# EAGLE design gatewayNode (EAGLE 7.2.0)
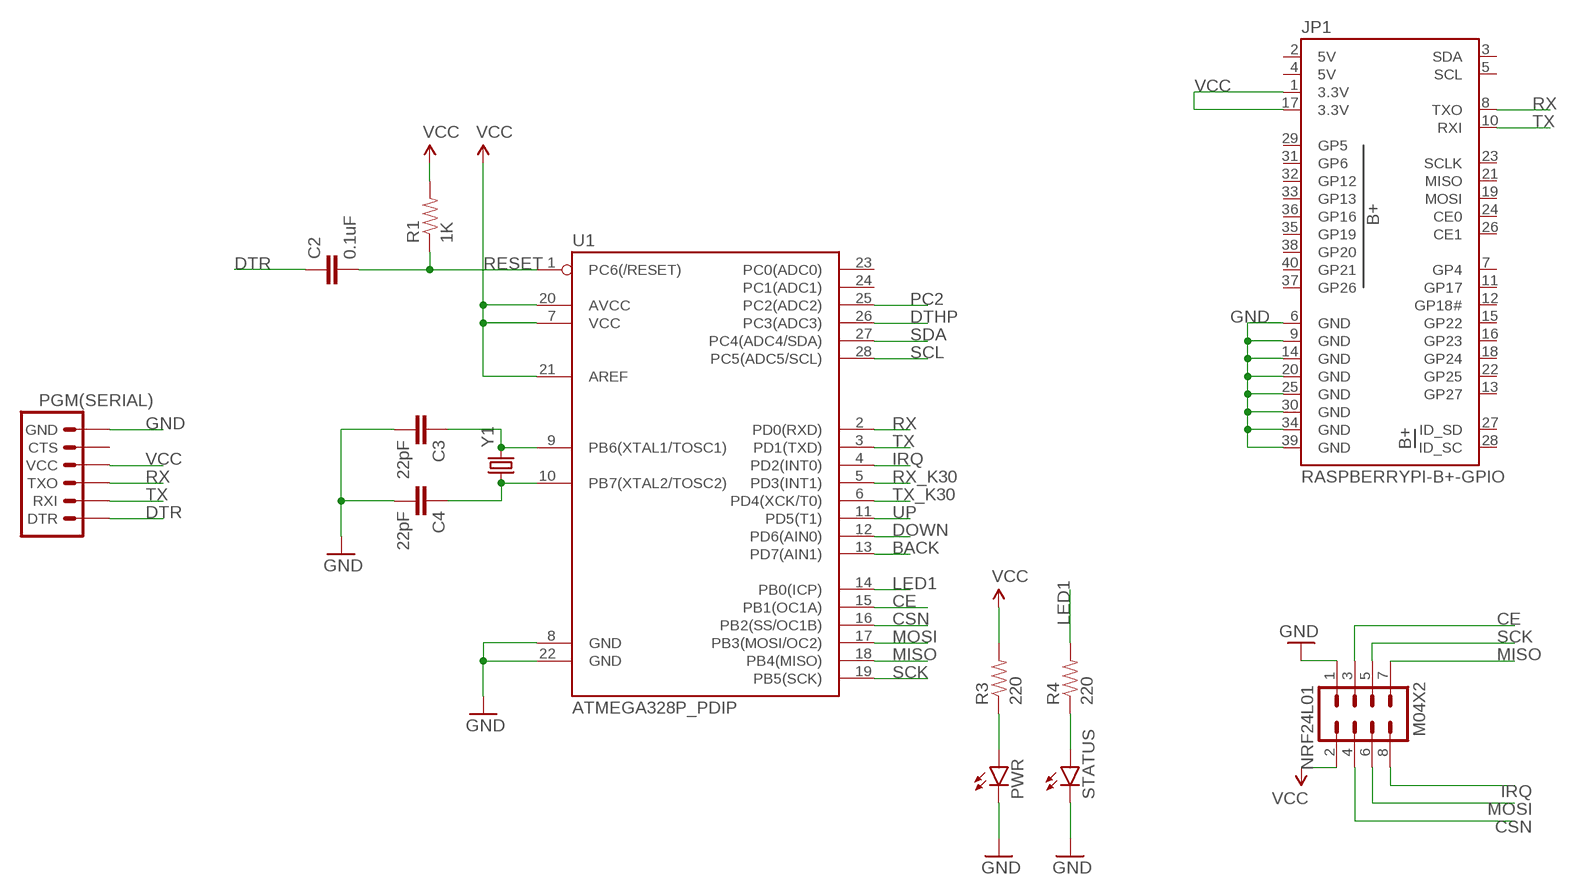
[diagram p0: schematic, sheet 1]

## Parts
C2  0.1uF  0.1UF-25V(+80/-20%)(0603)  [0603-CAP]
C3  22pF  22PF-50V-5%(0603)  [0603-CAP]
C4  22pF  22PF-50V-5%(0603)  [0603-CAP]
JP1  RASPBERRYPI-B+-GPIO  [2X20-SHROUDED]
NRF24L01  M04X2  [2X4]
PGM(SERIAL)  ARDUINO_SERIAL_PROGRAMPTH  [1X06]
PWR  LED0603  [LED-0603]
R1  1K  1KOHM-1/10W-1%(0603)  [0603-RES]
R3  220  1KOHM-1/10W-1%(0603)  [0603-RES]
R4  220  1KOHM-1/10W-1%(0603)  [0603-RES]
STATUS  LED0603  [LED-0603]
U1  ATMEGA328P_PDIP  [DIL28-3]
Y1  CRYSTALHC49US  [HC49US]

## Nets
BACK: U1.13(PD7(AIN1))
CE: NRF24L01.3 U1.15(PB1(OC1A))
CSN: NRF24L01.4 U1.16(PB2(SS/OC1B))
DOWN: U1.12(PD6(AIN0))
DTHP: U1.26(PC3(ADC3))
DTR: C2.1 PGM(SERIAL).1(DTR)
GND: C3.2 C4.2 JP1.6(GND) JP1.9(GND) JP1.14(GND) JP1.20(GND) JP1.25(GND) JP1.30(GND) JP1.34(GND) JP1.39(GND) NRF24L01.1 PGM(SERIAL).6(GND) PWR.C STATUS.C U1.8(GND) U1.22(GND)
IRQ: NRF24L01.8 U1.4(PD2(INT0))
LED1: R4.2 U1.14(PB0(ICP))
MISO: NRF24L01.7 U1.18(PB4(MISO))
MOSI: NRF24L01.6 U1.17(PB3(MOSI/OC2))
N$1: C3.1 U1.9(PB6(XTAL1/TOSC1)) Y1.2
N$2: C4.1 U1.10(PB7(XTAL2/TOSC2)) Y1.1
N$4: PWR.A R3.1
N$5: R4.1 STATUS.A
PC2: U1.25(PC2(ADC2))
RESET: C2.2 R1.1 U1.1(PC6(/RESET))
RX: JP1.8(TXO) PGM(SERIAL).3(TXO) U1.2(PD0(RXD))
RX_K30: U1.5(PD3(INT1))
SCK: NRF24L01.5 U1.19(PB5(SCK))
SCL: U1.28(PC5(ADC5/SCL))
SDA: U1.27(PC4(ADC4/SDA))
TX: JP1.10(RXI) PGM(SERIAL).2(RXI) U1.3(PD1(TXD))
TX_K30: U1.6(PD4(XCK/T0))
UP: U1.11(PD5(T1))
VCC: JP1.1(3.3V) JP1.17(3.3V) NRF24L01.2 PGM(SERIAL).4(VCC) R1.2 R3.2 U1.7(VCC) U1.20(AVCC) U1.21(AREF)
Unconnected: JP1.3(SDA) JP1.5(SCL) JP1.7(GP4) JP1.11(GP17) JP1.12(GP18#) JP1.13(GP27) JP1.15(GP22) JP1.16(GP23) JP1.18(GP24) JP1.19(MOSI) JP1.21(MISO) JP1.22(GP25) JP1.23(SCLK) JP1.24(CE0) JP1.26(CE1) JP1.27(ID_SD) JP1.28(ID_SC) JP1.29(GP5) JP1.31(GP6) JP1.32(GP12) JP1.33(GP13) JP1.35(GP19) JP1.36(GP16) JP1.37(GP26) JP1.38(GP20) JP1.40(GP21) PGM(SERIAL).5(CTS) U1.23(PC0(ADC0)) U1.24(PC1(ADC1))

## Power pins joined to a net without a drawn wire
5V: JP1.2(5V) JP1.4(5V)

## Library data of the parts
C2 = SparkFun-Capacitors:0.1UF-25V(+80/-20%)(0603): CAP-00810 Ceramic Standard decoupling cap; PROD_ID: CAP-00810
C3 C4 = SparkFun-Capacitors:22PF-50V-5%(0603): CAP-07876; PROD_ID: CAP-07876
JP1 = SparkFun-Boards:RASPBERRYPI-B+-GPIO: Raspberry Pi B+ GPIO Header 2x20 pin connector
NRF24L01 = SparkFun-Connectors:M04X2: .1" header, two rows of four.
PGM(SERIAL) = SparkFun-Connectors:ARDUINO_SERIAL_PROGRAM: FTDI connector footprints
PWR STATUS = SparkFun-LED:LED: LEDs Standard schematic elements and footprints for 5mm, 3mm, 1206, and 0603 sized LEDs. 5mm - Spark Fun Electronics SKU : COM-00529 (and others)
R1 = SparkFun-Resistors:1KOHM-1/10W-1%(0603): RES-07856; PROD_ID: RES-07856
R3 R4 = SparkFun-Resistors:1KOHM-1/10W-1%(0603): RES-07856; PROD_ID: RES-07856; VALUE: 1K
U1 = SparkFun-DigitalIC:ATMEGA328P_PDIP: uC used in the Arduino 32kb flash, 1k EEPROM, 2k SRAM This is the through-hole version of this chip.
Y1 = SparkFun-FreqCtrl:CRYSTAL: Various standard crystals. Proven footprints.

## Board
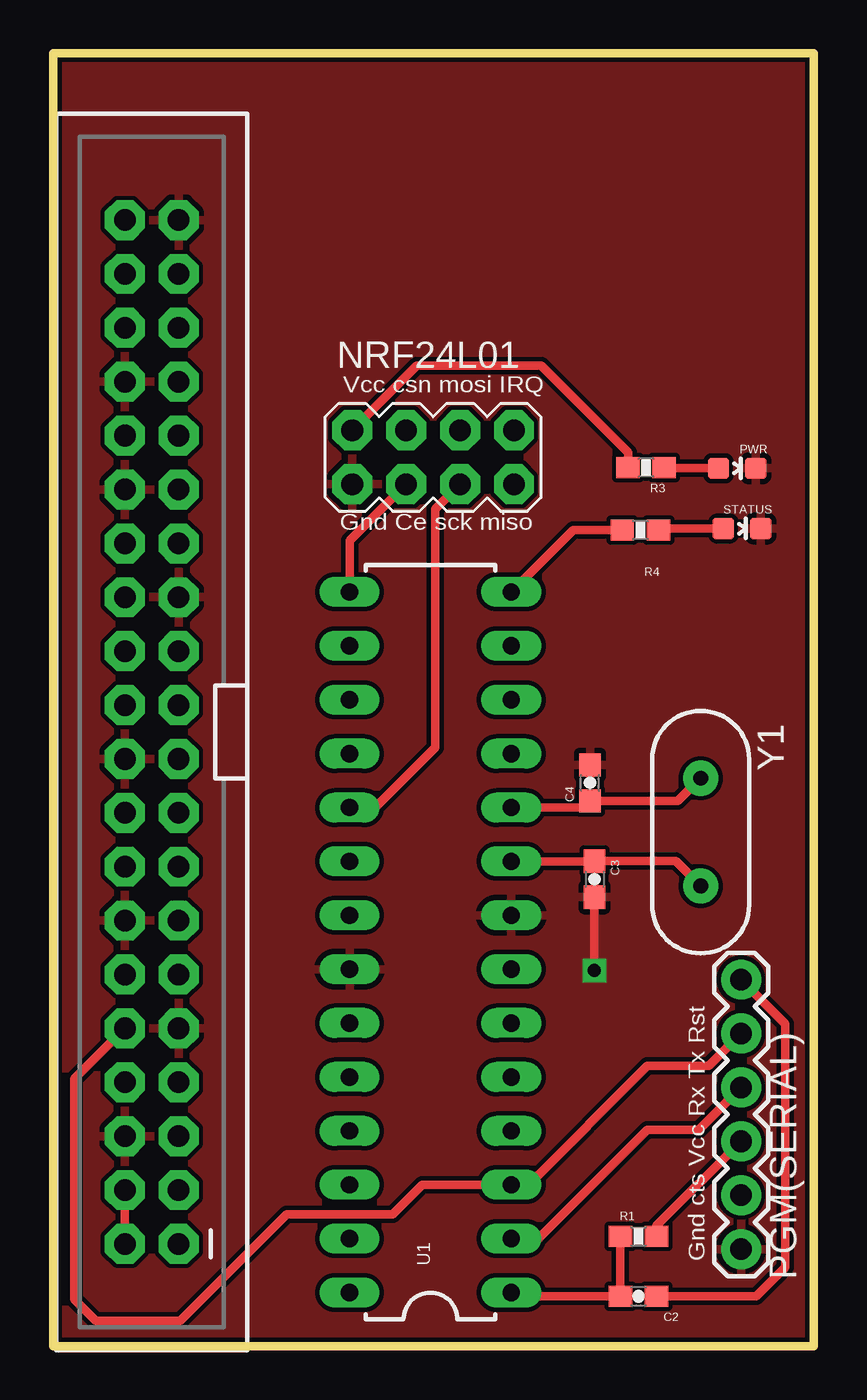
[diagram p1: board, top side]
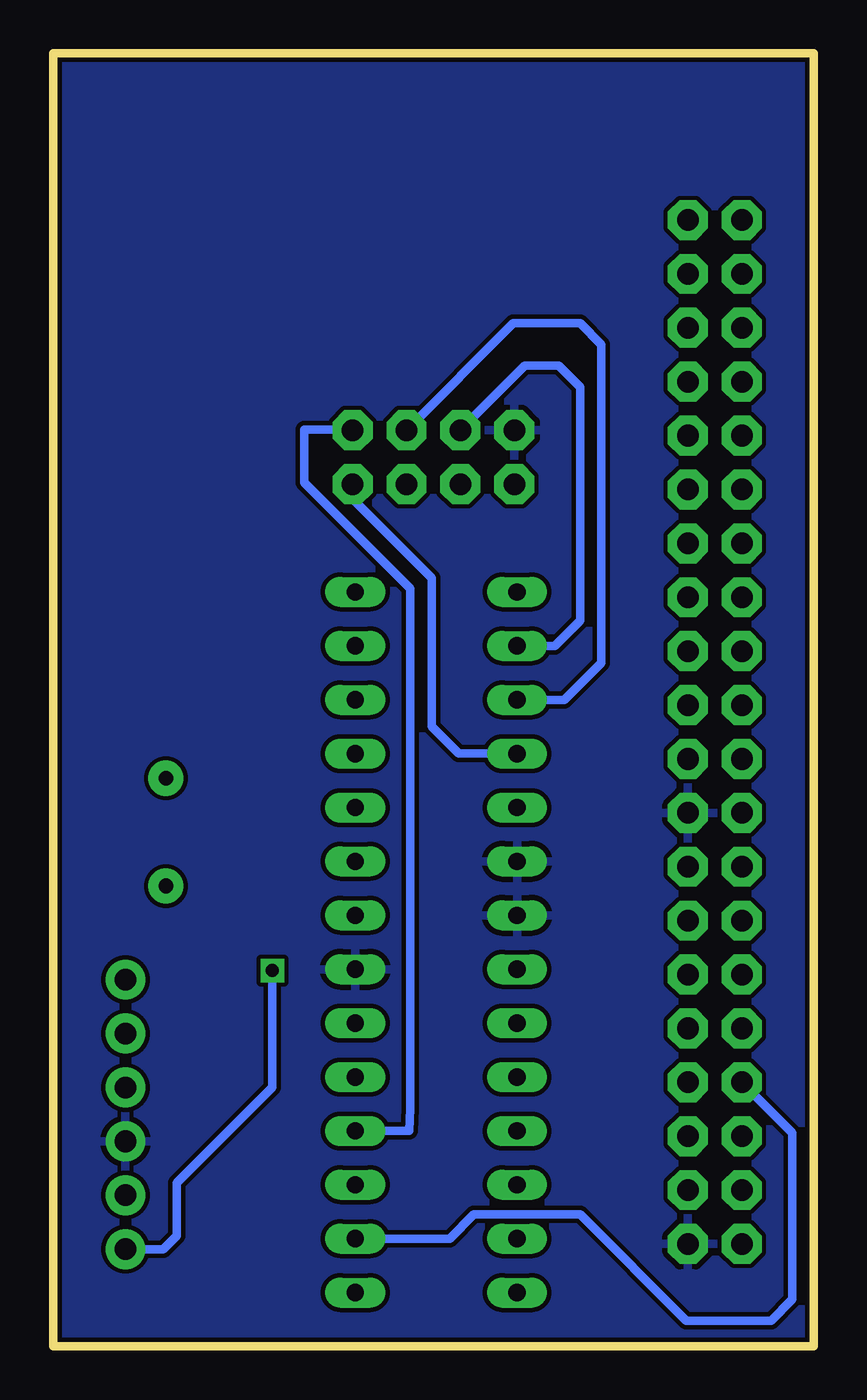
[diagram p2: board, bottom side, seen from below]

Size 35.83 x 60.96 mm. Coordinates in mm from the lower left corner, seen from the top.
Outline: 0,60.96 0,0 35.83,0 35.83,60.96 0,60.96
Copper layers (1*16): Top 0.035mm / dielectric 1.5mm / Bottom 0.035mm
Design rules "SparkFun": minimum track width 8mil, minimum drill 20mil, track to track 8mil, track to pad 8mil, pad to pad 8mil, via to via 8mil, smd to smd 8mil, copper to edge 8mil, drill to drill 8mil, minimum pad ring 12mil, minimum via ring 10mil, stop-mask expansion 4mil, vias tented up to drill 20mil, thermal gap 10mil

### Footprints (pad centres in the part's own frame; a part is rotated, then mirrored left to right if it is on the bottom)
0603-CAP = smd 1.1 x 1: 1 -0.85,0; 2 0.85,0
2X20-SHROUDED = drill 1.016 pad 1.88 octagon: 1 -1.27,24.13; 2 1.27,24.13; 3 -1.27,21.59; 4 1.27,21.59; 5 -1.27,19.05; 6 1.27,19.05; 7 -1.27,16.51; 8 1.27,16.51; 9 -1.27,13.97; 10 1.27,13.97; 11 -1.27,11.43; 12 1.27,11.43; 13 -1.27,8.89; 14 1.27,8.89; 15 -1.27,6.35; 16 1.27,6.35; 17 -1.27,3.81; 18 1.27,3.81; 19 -1.27,1.27; 20 1.27,1.27; 21 -1.27,-1.27; 22 1.27,-1.27; 23 -1.27,-3.81; 24 1.27,-3.81; 25 -1.27,-6.35; 26 1.27,-6.35; 27 -1.27,-8.89; 28 1.27,-8.89; 29 -1.27,-11.43; 30 1.27,-11.43; 31 -1.27,-13.97; 32 1.27,-13.97; 33 -1.27,-16.51; 34 1.27,-16.51; 35 -1.27,-19.05; 36 1.27,-19.05; 37 -1.27,-21.59; 38 1.27,-21.59; 39 -1.27,-24.13; 40 1.27,-24.13
2X4 = drill 1.016 pad 1.88 octagon: 1 -3.81,-1.27; 2 -3.81,1.27; 3 -1.27,-1.27; 4 -1.27,1.27; 5 1.27,-1.27; 6 1.27,1.27; 7 3.81,-1.27; 8 3.81,1.27
1X06 = drill 1.016 pad 1.88: 1 0,0; 2 2.54,0; 3 5.08,0; 4 7.62,0; 5 10.16,0; 6 12.7,0
LED-0603 = smd 1 x 1: A 0,-0.877; C 0,0.877
0603-RES = smd 1.1 x 1: 1 -0.85,0; 2 0.85,0
DIL28-3 = drill 0.813 long: 1 -16.51,-3.81; 2 -13.97,-3.81; 3 -11.43,-3.81; 4 -8.89,-3.81; 5 -6.35,-3.81; 6 -3.81,-3.81; 7 -1.27,-3.81; 8 1.27,-3.81; 9 3.81,-3.81; 10 6.35,-3.81; 11 8.89,-3.81; 12 11.43,-3.81; 13 13.97,-3.81; 14 16.51,-3.81; 15 16.51,3.81; 16 13.97,3.81; 17 11.43,3.81; 18 8.89,3.81; 19 6.35,3.81; 20 3.81,3.81; 21 1.27,3.81; 22 -1.27,3.81; 23 -3.81,3.81; 24 -6.35,3.81; 25 -8.89,3.81; 26 -11.43,3.81; 27 -13.97,3.81; 28 -16.51,3.81
HC49US = drill 0.7 pad 1.651: 1 -2.54,0; 2 2.54,0

### Placement (x,y rotation side)
C2  27.58,2.36 180 top
C3  25.51,22.02 270 top
C4  25.3,26.56 90 top
JP1  4.65,28.96 180 top
NRF24L01  17.91,41.91 0 top
PGM(SERIAL)  32.42,17.29 270 top
PWR  32.23,41.39 270 top
R1  27.58,5.19 0 top
R3  27.94,41.42 180 top
R4  27.67,38.48 180 top
STATUS  32.46,38.55 270 top
U1  17.78,19.05 90 top
Y1  30.51,24.24 270 top

### Tracks (layer width: path | path; a pad name or v marks a point on that pad's centre or on a via)
5V
  Top 0.406: JP1.2 JP1.4
CE
  Top 0.406: U1.15 13.97,37.97 NRF24L01.3
CSN
  Bottom 0.406: U1.16 12.2,33.02 11,34.22 11,45.22 12,46.22 13.6,46.22 NRF24L01.4
DTR
  Top 0.406: C2.1 33.14,2.36 34.5,3.72 34.5,15.21 PGM(SERIAL).1
GND  (via drill 0.6)
  Top 0.406: v25.5,17.72 C3.2
  Bottom 0.406: PGM(SERIAL).6 30.63,4.59 30,5.22 30,7.72 25.5,12.22 v25.5,17.72
  pour Top: 0,60.96 0,0 35.83,0 35.83,60.96
IRQ
  Bottom 0.406: U1.4 19.06,10.16 19,11.22 19,35.72 24,40.72 24,43.22 21.76,43.22 NRF24L01.8
LED1
  Top 0.406: R4.2 24.51,38.48 U1.14
MISO
  Bottom 0.406: U1.18 16.72,27.94 18,29.22 18,36.22 22,40.22 22,40.36 NRF24L01.7
MOSI
  Bottom 0.406: U1.17 11.74,30.48 10,32.22 10,47.22 11,48.22 14.14,48.22 NRF24L01.6
N$1
  Top 0.406: U1.9 25.5,22.86 C3.1 29.34,22.88 Y1.2
N$2
  Top 0.406: U1.10 24.99,25.4 C4.1 29.44,25.71 Y1.1
N$4
  Top 0.406: PWR.A 28.82,41.39 R3.1
N$5
  Top 0.406: STATUS.A 28.59,38.55 R4.1
RESET
  Top 0.406: U1.1 21.77,2.36 C2.2 R1.1
RX
  Top 0.406: U1.2 22.86,5.08 28,10.22 30.43,10.22 PGM(SERIAL).3
  Bottom 0.406: U1.2 17.14,5.08 16,6.22 11,6.22 6,1.22 2,1.22 1,2.22 1,10.07 JP1.8
SCK
  Top 0.406: U1.19 15.18,25.4 18,28.22 18,39.46 NRF24L01.5
TX
  Top 0.406: PGM(SERIAL).2 30.89,13.22 28,13.22 22.4,7.62 U1.3 17.4,7.62 16,6.22 11,6.22 6,1.22 2,1.22 1,2.22 1,12.61 JP1.10
VCC
  Top 0.406: R1.2 28.43,5.68 PGM(SERIAL).4 | R3.2 27.09,42.13 23,46.22 17.14,46.22 NRF24L01.2
  pour Bottom: 0,60.96 35.83,60.96 35.83,0 0,0

### Text on the board
tNames: Vcc csn mosi IRQ | Gnd Ce sck miso | Gnd cts Vcc Rx Tx Rst